# EAGLE design DCP23 (EAGLE 9.3.0)
Assembly variants: BASIC
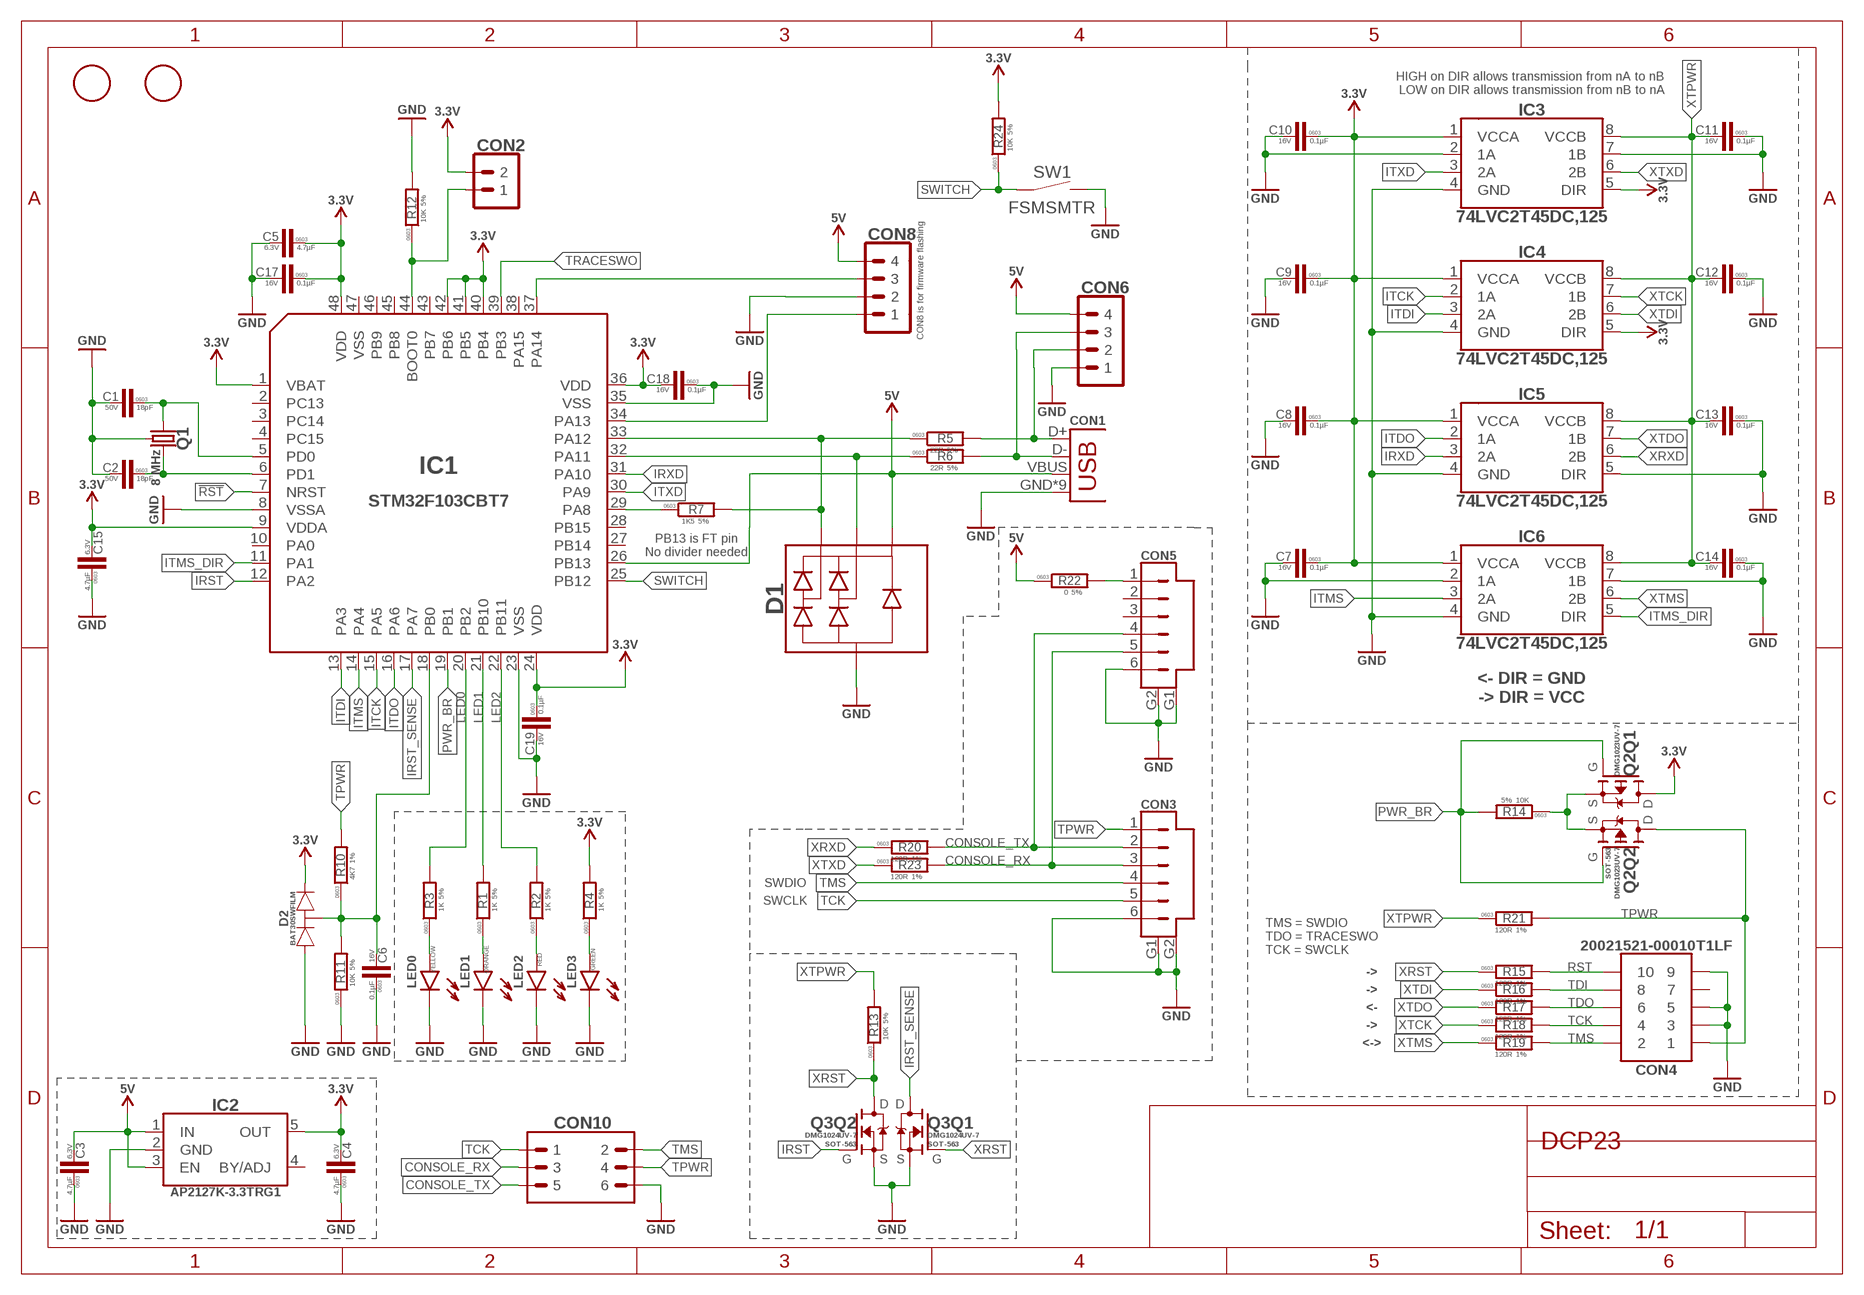
[diagram p0: schematic, sheet 1]

## Parts
C1  18pF  18PF-50V_5%_NP0-0603  [C0603]
C2  18pF  18PF-50V_5%_NP0-0603  [C0603]
C3  4.7µF  4.7µF-6.3V_10%_X5R-0603  [C0603]
C4  4.7µF  4.7µF-6.3V_10%_X5R-0603  [C0603]
C5  4.7µF  4.7µF-6.3V_10%_X5R-0603  [C0603]
C6  0.1µF  0.1µF-16V_10%_X7R-0603  [C0603]
C7  0.1µF  0.1µF-16V_10%_X7R-0603  [C0603]
C8  0.1µF  0.1µF-16V_10%_X7R-0603  [C0603]
C9  0.1µF  0.1µF-16V_10%_X7R-0603  [C0603]
C10  0.1µF  0.1µF-16V_10%_X7R-0603  [C0603]
C11  0.1µF  0.1µF-16V_10%_X7R-0603  [C0603]
C12  0.1µF  0.1µF-16V_10%_X7R-0603  [C0603]
C13  0.1µF  0.1µF-16V_10%_X7R-0603  [C0603]
C14  0.1µF  0.1µF-16V_10%_X7R-0603  [C0603]
C15  4.7µF  4.7µF-6.3V_10%_X5R-0603  [C0603]
C17  0.1µF  0.1µF-16V_10%_X7R-0603  [C0603]
C18  0.1µF  0.1µF-16V_10%_X7R-0603  [C0603]
C19  0.1µF  0.1µF-16V_10%_X7R-0603  [C0603]
CON1  USB-1  [MICRO_USB_WITH_PEGS]
CON2  PINHEAD_1X02-2  [1X02-PTH-2]  (not fitted in variant BASIC)
CON3  CON-6P-SM06B  [SM06B]
CON4  CON-2X5P  [200215-00010T1LF]
CON5  CON-6P-DF13  [DF13C-6P-1.25V]
CON6  PINHEAD_1X04-2.54  [1X04-PTH-2.54]  (not fitted in variant BASIC)
CON8  PINHEAD_1X04-2.54  [1X04-PTH-2.54]  (not fitted in variant BASIC)
CON10  PINHEAD_2X03-PTH-2.54  [2X03-PTH-2.54]  (not fitted in variant BASIC)
D1  PRTR5V0U2X  [SOT143B]
D2  BAT30SWFILM  [SC70]
IC1  STM32F103CBT7  [LQFP48]
IC2  AP2127-3.3  [SOT23-5]
IC3  74LVC2T45  [VSSOP8]
IC4  74LVC2T45  [VSSOP8]
IC5  74LVC2T45  [VSSOP8]
IC6  74LVC2T45  [VSSOP8]
LED0  LED-0603  [LED0603]
LED1  LED-0603  [LED0603]
LED2  LED-0603  [LED0603]
LED3  LED-0603  [LED0603]
Q1  8 MHz  CRYSTAL-4P-8MHZ-3.2X5-4P  [OSCILLATOR-5.0X3.2-4P]
Q2  DMG1023UV-7  [SOT-563]
Q3  DMG1024UV-7  [SOT-563]
R1  1K  1K-5%-0603  [R0603]
R2  1K  1K-5%-0603  [R0603]
R3  1K  1K-5%-0603  [R0603]
R4  1K  1K-5%-0603  [R0603]
R5  22R  R-5%-0603  [R0603]
R6  22R  R-5%-0603  [R0603]
R7  1K5  R-5%-0603  [R0603]
R10  4K7  4K7-1%-0603  [R0603]
R11  10K  10K-5%-0603  [R0603]
R12  10K  10K-5%-0603  [R0603]
R13  10K  10K-5%-0603  [R0603]
R14  10K  10K-5%-0603  [R0603]
R15  120R  120R-1%-0603  [R0603]
R16  120R  120R-1%-0603  [R0603]
R17  120R  120R-1%-0603  [R0603]
R18  120R  120R-1%-0603  [R0603]
R19  120R  120R-1%-0603  [R0603]
R20  120R  120R-1%-0603  [R0603]
R21  120R  120R-1%-0603  [R0603]
R22  0  0R-5%-0603  [R0603]
R23  120R  120R-1%-0603  [R0603]
R24  10K  10K-5%-0603  [R0603]
SW1  TACT_SWITCH-FSMSM  [FSMSM]
U$9  FIDUCIALMOUNT  [FIDUCIA-MOUNT]  (not fitted in variant BASIC)
U$10  FIDUCIALMOUNT  [FIDUCIA-MOUNT]  (not fitted in variant BASIC)

## Nets
!RST: IC1.7(NRST)
CONSOLE_RX: CON3.3 CON5.5 CON10.3 R23.P$2
CONSOLE_TX: CON3.2 CON5.4 CON10.5 R20.P$2
GND: C1.P$2 C2.P$2 C3.P$1 C4.P$1 C5.P$2 C6.P$1 C7.P$2 C8.P$2 C9.P$2 C10.P$2 C11.P$1 C12.P$1 C13.P$1 C14.P$1 C15.P$1 C17.P$2 C18.P$1 C19.P$2 CON1.GND CON1.GND1(GND) CON1.GND2(GND) CON1.GND3(GND) CON1.GND4(GND) CON1.P$1(GND) CON1.P$2(GND) CON1.P$3(GND) CON1.P$4(GND) CON3.6 CON3.G1 CON3.G2 CON4.3 CON4.5 CON4.9 CON5.6 CON5.G1(G2) CON5.G2(G1) CON6.1 CON8.2 CON10.6 D1.1(C) D2.1(A) IC1.8(VSSA) IC1.23(VSS) IC1.35(VSS) IC2.2(GND) IC3.2(1A) IC3.4(GND) IC3.7(1B) IC4.4(GND) IC5.4(GND) IC5.5(DIR) IC6.2(1A) IC6.4(GND) IC6.7(1B) LED0.C LED1.C LED2.C LED3.C Q1.2(GND) Q1.4(GND) Q3.1(Q1:S) Q3.4(Q2:S) R11.P$1 R12.P$2 SW1.P$2
IRST: IC1.12(PA2) Q3.5(Q2:G)
IRST_SENSE: IC1.17(PA7) Q3.6(Q1:D)
IRXD: IC1.31(PA10) IC5.3(2A)
ITCK: IC1.15(PA5) IC4.2(1A)
ITDI: IC1.13(PA3) IC4.3(2A)
ITDO: IC1.16(PA6) IC5.2(1A)
ITMS: IC1.14(PA4) IC6.3(2A)
ITMS_DIR: IC1.11(PA1) IC6.5(DIR)
ITXD: IC1.30(PA9) IC3.3(2A)
LED0: IC1.20(PB2) R3.P$2
LED1: IC1.21(PB10) R1.P$2
LED2: IC1.22(PB11) R2.P$2
N$1: C1.P$1 IC1.5(PD0) Q1.1
N$2: LED0.A R3.P$1
N$3: C2.P$1 IC1.6(PD1) Q1.3
N$4: LED2.A R2.P$1
N$5: LED1.A R1.P$1
N$6: LED3.A R4.P$1
N$7: IC1.29(PA8) R7.1
N$8: D1.3(D2) IC1.32(PA11) R6.1
N$9: D1.2(D1) IC1.33(PA12) R5.1 R7.2
N$12: Q2.1(Q2:S) Q2.4(Q1:S) R14.P$1
N$13: CON5.1 R22.P$2
N$15: CON2.1 IC1.44(BOOT0) R12.P$1
PWR_BR: IC1.19(PB1) Q2.2(Q2:G) Q2.5(Q1:G) R14.P$2
RST: CON4.10 R15.P$2
SWCLK: CON8.3 IC1.37(PA14)
SWDIO: CON8.1 IC1.34(PA13)
SWITCH: IC1.25(PB12) R24.P$1 SW1.P$1
TCK: CON3.5 CON4.4 CON10.1 R18.P$2
TDI: CON4.8 R16.P$2
TDO: CON4.6 R17.P$2
TMS: CON3.4 CON4.2 CON10.2 R19.P$2
TPWR: CON3.1 CON4.1 CON10.4 Q2.6(Q2:D) R10.P$2 R21.P$2
TRACESWO: IC1.39(PB3)
USB_DM: CON1.D- CON6.3 R6.2
USB_DP: CON1.D+ CON6.2 R5.2
VBUS1: C6.P$2 D2.3(COMMON) IC1.18(PB0) R10.P$1 R11.P$2
VDD_3V3: C4.P$2 C5.P$1 C7.P$1 C8.P$1 C9.P$1 C10.P$1 C15.P$2 C17.P$1 C18.P$2 C19.P$1 CON2.2 D2.2(C) IC1.1(VBAT) IC1.9(VDDA) IC1.24(VDD) IC1.36(VDD) IC1.40(PB4) IC1.41(PB5) IC1.42(PB6) IC1.48(VDD) IC2.5(OUT) IC3.1(VCCA) IC3.5(DIR) IC4.1(VCCA) IC4.5(DIR) IC5.1(VCCA) IC6.1(VCCA) Q2.3(Q1:D) R4.P$2 R24.P$2 ; supply symbol labelled 3.3V
VDD_5V: C3.P$2 CON1.VBUS CON6.4 CON8.4 D1.4(A) IC1.26(PB13) IC2.1(IN) IC2.3(EN) R22.P$1 ; supply symbol labelled 5V
XRST: Q3.2(Q1:G) Q3.3(Q2:D) R13.P$1 R15.P$1
XRXD: IC5.6(2B) R20.P$1
XTCK: IC4.7(1B) R18.P$1
XTDI: IC4.6(2B) R16.P$1
XTDO: IC5.7(1B) R17.P$1
XTMS: IC6.6(2B) R19.P$1
XTPWR: C11.P$2 C12.P$2 C13.P$2 C14.P$2 IC3.8(VCCB) IC4.8(VCCB) IC5.8(VCCB) IC6.8(VCCB) R13.P$2 R21.P$1
XTXD: IC3.6(2B) R23.P$1
Unconnected: CON4.7 CON5.2 CON5.3 IC1.2(PC13) IC1.3(PC14) IC1.4(PC15) IC1.10(PA0) IC1.27(PB14) IC1.28(PB15) IC1.38(PA15) IC1.43(PB7) IC1.45(PB8) IC1.46(PB9) IC1.47(VSS) IC2.4(BY/ADJ)

## Notes on the sheet
- HIGH on DIR allows transmission from nA to nB 
  LOW on DIR allows transmission from nB to nA
- CON8 is for firmware flashing
- PB13 is FT pin
  No divider needed
- <- DIR = GND
  -> DIR = VCC
- SWDIO
- SWCLK
- TMS = SWDIO
  TDO = TRACESWO
  TCK = SWCLK
- ->
- ->
- <-
- ->
- <->

## Library data of the parts
C1 C2 = C_digikey:18PF; DIGIKEY#: 445-1272-2-ND; MANF: TDK Corporation; MANF#: C1608C0G1H180J080AA; OPERATING_TEMP: -55°C ~ 125°C; PACKAGE: 0603; TC: C0G, NP0; TOLERANCE: +-5%; VOLTAGE: 50V
C3-C5 C15 = C_digikey:4.7µF; DIGIKEY#: 490-3297-1-ND; MANF: Murata Electronics North America; MANF#: GRM188R60J475KE19D; OPERATING_TEMP: -55°C ~ 85°C; PACKAGE: 0603; TC: X5R; TOLERANCE: +-10%; VOLTAGE: 6.3V
C6-C14 C17-C19 = C_digikey:0.1µF; DIGIKEY#: 490-1532-1-ND; MANF: Murata Electronics North America; MANF#: GRM188R71C104KA01D; OPERATING_TEMP: -55°C ~ 125°C; PACKAGE: 0603; TC: X7R; TOLERANCE: +-10%; VOLTAGE: 16V
CON1 = Connectors:USB: Connector Receptacle USB - micro B 2.0 5 Position; DIGIKEY#: 609-4616-1-ND; MANF: FCI; MANF#: 10118193-0001LF
CON2 = pinhead:PINHEAD_1X02: pinheader 2P
CON3 = Connectors:CON-6P: CONN HEADER 6 POS; DIGIKEY#: 455-1806-1-ND; MANF: JST Sales America Inc; MANF#: SM06B-SRSS-TB(LF)(SN)
CON4 = Connectors:CON-2X5P; DIGIKEY#: 609-4054-ND; MANF: Amphenol ICC (FCI); MANF#: 20021521-00010T1LF
CON5 = Connectors:CON-6P: CONN HEADER 6 POS; DIGIKEY#: H3423-ND; MANF: Hirose Electric Co Ltd; MANF#: DF13C-6P-1.25V(20)
CON6 CON8 = pinhead:PINHEAD_1X04
CON10 = pinhead:PINHEAD_2X03
D1 = TVS_diodes:PRTR5V0U2X; DIGIKEY#: 568-4140-2-ND; MANF: NXP USA Inc; MANF#: PRTR5V0U2X,215
D2 = Diodes:BAT30SWFILM: Diode Array 1 Pair Series Connection Schottky 30V 300mA (DC) Surface Mount SC-70, SOT-323; DIGIKEY#: 497-5553-2-ND; MANF: STMicroelectronics; MANF#: BAT30SWFILM
IC1 = stm32:STM32F103CBT7: ARM® Cortex®-M3 STM32F1 Microcontroller IC 32-Bit 72MHz 128KB (128K x 8) FLASH 48-LQFP (7x7); DIGIKEY#: 497-11518-ND; MANF: STMicroelectronics; MANF#: STM32F103CBT7
IC2 = linear regulators:AP2127: IC REG LINEAR 3.3V 300MA SOT23-5; DIGIKEY#: AP2127K-3.3TRG1DITR-ND; I_MAX: 300mA; MANF: Diodes Incorporated; MANF#: AP2127K-3.3TRG1; V_MAX: 6V
IC3-IC6 = misc:74LVC2T45: Voltage Level Translator Bidirectional 1 Circuit 2 Channel 420Mbps; DIGIKEY#: 1727-4578-2-ND; MANF: Nexperia USA Inc; MANF#: 74LVC2T45DC,125
LED0 = rc:LED: SMD LED; COLOR: YELLOW; DIGIKEY#: 160-1448-1-ND
LED1 = rc:LED: SMD LED; COLOR: ORANGE; DIGIKEY#: 160-1445-1-ND
LED2 = rc:LED: SMD LED; COLOR: RED; DIGIKEY#: SML-D12U1WT86CT-ND
LED3 = rc:LED: SMD LED; COLOR: GREEN; DIGIKEY#: 160-1446-1-ND
Q1 = crystal:CRYSTAL-4P: Smd Crystal 18pF; DIGIKEY#: 535-9720-2-ND; MANF: Abracon LLC; MANF#: ABM3B-8.000MHZ-B2-T
Q2 = mosfet:DMG1023UV-7: Mosfet Array 2 P-Channel (Dual) 20V 1.03A 530mW Surface Mount SOT-563; DIGIKEY#: DMG1023UV-7DICT-ND; MANF: Diodes Incorporated; MANF#: DMG1023UV-7; PACKAGE: SOT-563
Q3 = mosfet:DMG1024UV-7: Mosfet Array 2 N-Channel (Dual) 20V 1.38A 530mW Surface Mount SOT-563; DIGIKEY#: DMG1024UV-7DICT-ND; MANF: Diodes Incorporated; MANF#: DMG1024UV-7; PACKAGE: SOT-563
R1-R4 = R_digikey:1K; DIGIKEY#: 311-1.0KGRCT-ND; MANF: Yageo; MANF#: RC0603JR-071KL; PACKAGE: 0603; TOLERANCE: 5%
R5 R6 = rc:R; DIGIKEY#: 311-22NCT-ND; MANF: Yageo; MANF#: RC0201JR-0722RL; PACKAGE: 0603; TOLERANCE: 5%
R7 = rc:R; DIGIKEY#: 311-1.50KHRCT-ND; MANF: Yageo; MANF#: RC0603FR-071K5L; PACKAGE: 0603; TOLERANCE: 5%
R10 = R_digikey:4K7; DIGIKEY#: 311-4.70KHRCT-ND; MANF: Yageo; MANF#: RC0603FR-074K7L; PACKAGE: 0603; TOLERANCE: 1%
R11-R14 R24 = R_digikey:10K; DIGIKEY#: 311-10KGRCT-ND; MANF: Yageo; MANF#: RC0603JR-0710KL; PACKAGE: 0603; TOLERANCE: 5%
R15-R21 R23 = R_digikey:120R; DIGIKEY#: YAG3563CT-ND; MANF: Yageo; MANF#: AC0603FR-07120RL; PACKAGE: 0603; TOLERANCE: 1%
R22 = R_digikey:0R; DIGIKEY#: 311-0.0GRCT-ND; MANF: Yageo; MANF#: RC0603JR-070RL; PACKAGE: 0603; TOLERANCE: 5%
SW1 = misc:TACT_SWITCH: tact switch; DIGIKEY#: 450-1140-ND; I: 0.05A; MANF: TE Connectivity ALCOSWITCH Switches; MANF#: FSMSMTR; V: 24V
U$9 U$10 = usb2can_master_lib:FIDUCIALMOUNT

## Board
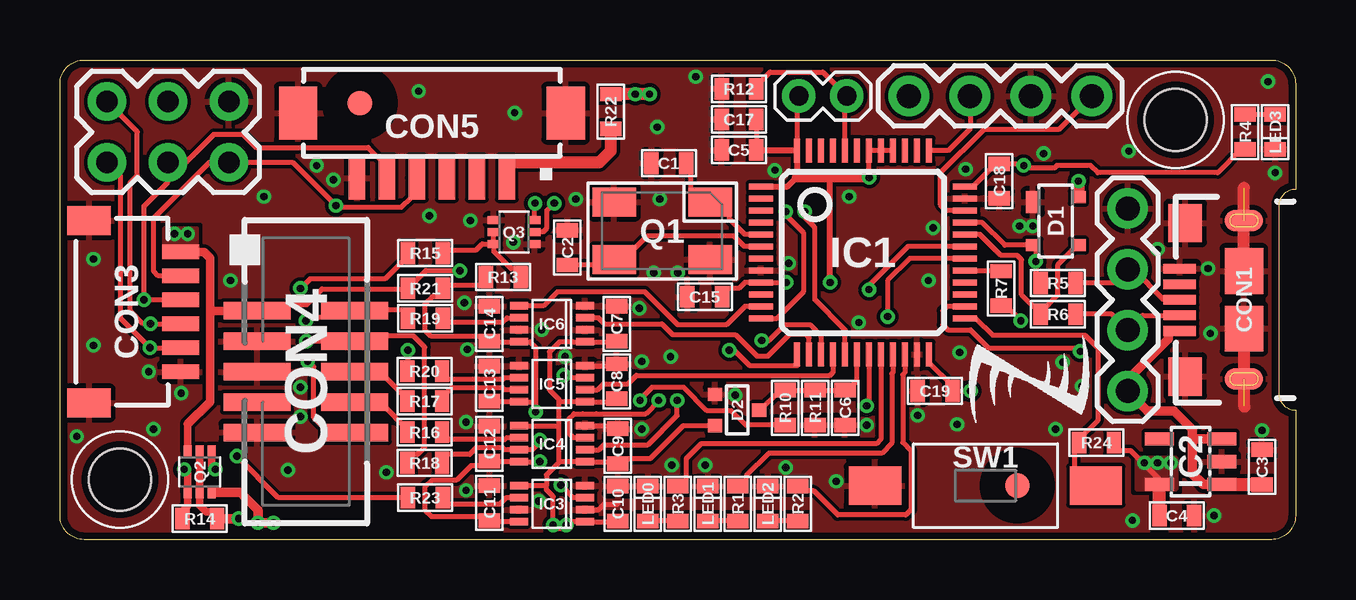
[diagram p1: board, top side]
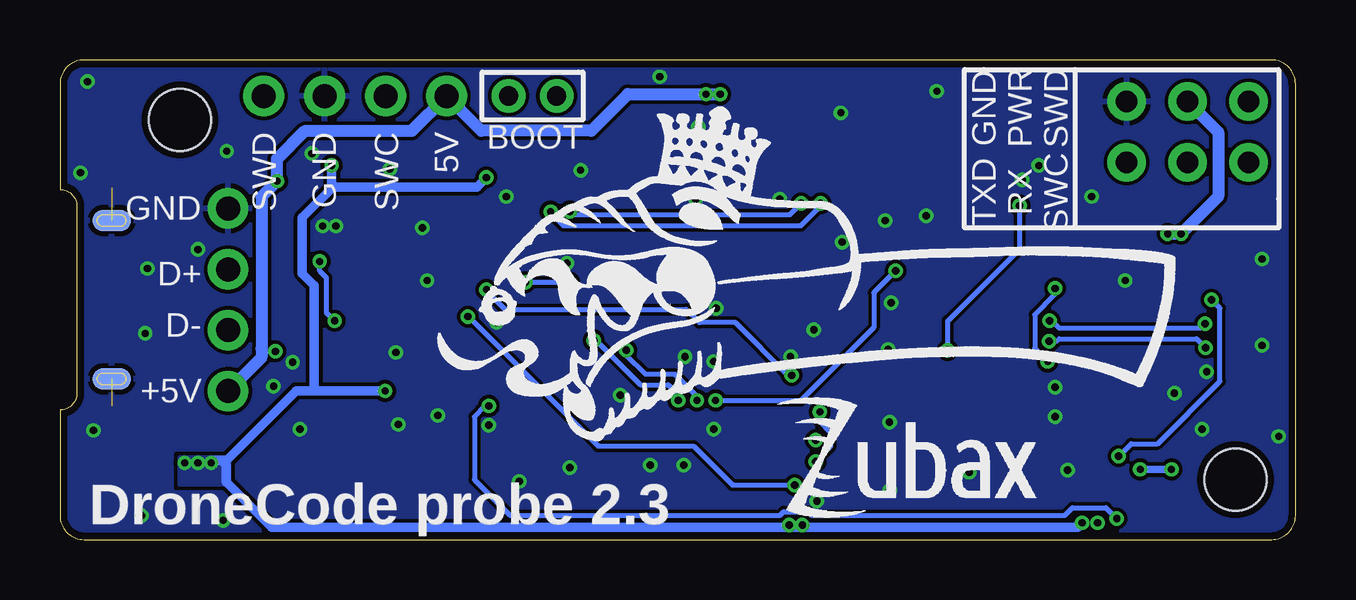
[diagram p2: board, bottom side, seen from below]

Size 51.5 x 20 mm. Coordinates in mm from the lower left corner, seen from the top.
Outline: 51.5,5.4 51.5,1 arc-90 50.5,0 1,0 arc-90 0,1 0,19 arc-90 1,20 50.5,20 arc-90 51.5,19 51.5,14.6 arc90 50.8,13.9 50.8,12.7 50.8,6.1 arc90 51.5,5.4
Copper layers (1*16): Top 0.035mm / dielectric 1.2mm / Bottom 0.035mm
Design rules "design_rules *": minimum track width 0.2mm, minimum drill 0.2mm, track to track 0.15mm, track to pad 0.15mm, pad to pad 0.15mm, via to via 0.15mm, smd to smd 0.15mm, copper to edge 0.3mm, drill to drill 0.2mm, minimum pad ring 0.125mm, minimum via ring 0.125mm, stop-mask expansion 1mil, vias tented up to drill 0.31mm, thermal gap 8mil
Holes 2.6 mm at 2.5,2.5 46.5,17.5

### Footprints (pad centres in the part's own frame; a part is rotated, then mirrored left to right if it is on the bottom)
C0603 = smd 0.6 x 0.9: P$1 -0.725,0; P$2 0.725,0
MICRO_USB_WITH_PEGS = smd 0.4 x 1.35: D+ 0,2.68; D- -0.65,2.68; GND 1.3,2.68; ID 0.65,2.68; VBUS -1.3,2.68 | smd 1.9 x 1.6: GND1 -1.2,0; GND2 1.2,0 | smd 1.6 x 1.4: GND3 -3.2,2.45; GND4 3.2,2.45 | smd 0.9 x 1.6: P$1 -3.3,0; P$2 3.3,0 | smd 0.9 x 1.6 bottom: P$3 -3.3,0; P$4 3.3,0
1X02-PTH-2 = drill 0.8 pad 1.4: 1 -1,0; 2 1,0
SM06B = smd 0.6 x 1.55: 1 -2.5,2.275; 2 -1.5,2.275; 3 -0.5,2.275; 4 0.5,2.275; 5 1.5,2.275; 6 2.5,2.275 | smd 1.2 x 1.8: G1 -3.8,-1.55; G2 3.8,-1.55
200215-00010T1LF = smd 0.737 x 2.794: 1 -2.54,-2.032; 2 -2.54,2.032; 3 -1.27,-2.032; 4 -1.27,2.032; 5 0,-2.032; 6 0,2.032; 7 1.27,-2.032; 8 1.27,2.032; 9 2.54,-2.032; 10 2.54,2.032
DF13C-6P-1.25V = smd 0.7 x 1.8: 1 -3.125,2.17; 2 -1.875,2.17; 3 -0.625,2.17; 4 0.625,2.17; 5 1.875,2.17; 6 3.125,2.17 | smd 1.6 x 2.2: G1 -5.575,-0.53; G2 5.575,-0.53
1X04-PTH-2.54 = drill 1 pad 1.7: 1 -3.81,0; 2 -1.27,0; 3 1.27,0; 4 3.81,0
2X03-PTH-2.54 = drill 0.9 pad 1.6: 1 -1.27,2.54; 2 1.27,2.54; 3 -1.27,0; 4 1.27,0; 5 -1.27,-2.54; 6 1.27,-2.54
SOT143B = smd 0.9 x 0.6: 1 -0.8,-0.95 | smd 0.5 x 0.6: 2 1,-0.95; 3 1,0.95; 4 -1,0.95
SC70 = smd 0.55 x 0.6: 1 -0.65,-0.925; 2 0.65,-0.925; 3 0,0.925
LQFP48 = smd 1 x 0.25: 1 -4.25,2.75; 2 -4.25,2.25; 3 -4.25,1.75; 4 -4.25,1.25; 5 -4.25,0.75; 6 -4.25,0.25; 7 -4.25,-0.25; 8 -4.25,-0.75; 9 -4.25,-1.25; 10 -4.25,-1.75; 11 -4.25,-2.25; 12 -4.25,-2.75; 25 4.25,-2.75; 26 4.25,-2.25; 27 4.25,-1.75; 28 4.25,-1.25; 29 4.25,-0.75; 30 4.25,-0.25; 31 4.25,0.25; 32 4.25,0.75; 33 4.25,1.25; 34 4.25,1.75; 35 4.25,2.25; 36 4.25,2.75 | smd 0.25 x 1: 13 -2.75,-4.25; 14 -2.25,-4.25; 15 -1.75,-4.25; 16 -1.25,-4.25; 17 -0.75,-4.25; 18 -0.25,-4.25; 19 0.25,-4.25; 20 0.75,-4.25; 21 1.25,-4.25; 22 1.75,-4.25; 23 2.25,-4.25; 24 2.75,-4.25; 37 2.75,4.25; 38 2.25,4.25; 39 1.75,4.25; 40 1.25,4.25; 41 0.75,4.25; 42 0.25,4.25; 43 -0.25,4.25; 44 -0.75,4.25; 45 -1.25,4.25; 46 -1.75,4.25; 47 -2.25,4.25; 48 -2.75,4.25
SOT23-5 = smd 0.55 x 1.2: 1 -0.95,-1.3; 2 0,-1.3; 3 0.95,-1.3; 4 0.95,1.3; 5 -0.95,1.3
VSSOP8 = smd 0.75 x 0.3: 1 -1.375,0.75; 2 -1.375,0.25; 3 -1.375,-0.25; 4 -1.375,-0.75; 5 1.375,-0.75; 6 1.375,-0.25; 7 1.375,0.25; 8 1.375,0.75
LED0603 = smd 0.6 x 0.9: A -0.725,0; C 0.725,0
OSCILLATOR-5.0X3.2-4P = smd 1.8 x 1.2: 1 -2,-1.2; 2 2,-1.2; 3 2,1.2; 4 -2,1.2
SOT-563 = smd 0.5 x 0.325: 1 -0.85,0.5; 2 -0.85,0; 3 -0.85,-0.5; 4 0.85,-0.5; 5 0.85,0; 6 0.85,0.5
R0603 = smd 0.6 x 0.9: P$1 -0.725,0; P$2 0.725,0
R0603' = smd 0.6 x 0.9: 1 -0.725,0; 2 0.725,0
FSMSM = smd 2.18 x 1.6: P$1 -4.6,0; P$2 4.6,0
FIDUCIA-MOUNT = smd 1.016 x 1.016: P$1 0,0

### Placement (x,y rotation side)
C1  25.38,15.7 180 top
C2  21.15,12.18 90 top
C3  50.1,3.03 270 top
C4  46.55,1 180 top
C5  28.3,16.25 180 top
C6  32.73,5.5 90 top
C7  23.2,9 90 top
C8  23.2,6.6 90 top
C9  23.25,3.9 90 top
C10  23.25,1.5 90 top
C11  17.9,1.53 270 top
C12  17.9,4 270 top
C13  17.9,6.5 270 top
C14  17.9,9 270 top
C15  26.88,10.12 0 top
C17  28.3,17.52 180 top
C18  39.15,14.95 90 top
C19  36.48,6.2 180 top
CON1  49.35,10 90 top
CON2  31.8,18.5 180 top
CON3  2.76,9.5 270 top
CON4  10.25,7 270 top
CON5  15.5,17.25 180 top
CON6  44.5,10 270 top
CON8  39.2,18.5 180 top
CON10  4.5,17 90 top
D1  41.5,13.28 270 top
D2  28.23,5.4 270 top
IC1  33.48,11.97 0 top
IC2  47.12,3.25 90 top
IC3  20.5,1.5 180 top
IC4  20.5,4 180 top
IC5  20.5,6.5 180 top
IC6  20.5,9 180 top
LED0  24.5,1.5 90 top
LED1  27,1.5 90 top
LED2  29.5,1.5 90 top
LED3  50.65,17 270 top
Q1  25.1,12.88 180 top
Q2  5.82,2.83 90 top
Q3  18.93,12.82 0 top
R1  28.25,1.5 90 top
R2  30.75,1.5 90 top
R3  25.75,1.5 90 top
R4  49.4,17 270 top
R5  22R  [R0603']  41.6,10.7 0 top
R6  22R  [R0603']  41.6,9.4 0 top
R7  1K5  [R0603']  39.23,10.47 270 top
R10  30.23,5.5 270 top
R11  31.48,5.5 90 top
R12  28.3,18.8 180 top
R13  18.48,10.95 180 top
R14  5.82,0.88 0 top
R15  15.22,11.95 180 top
R16  15.2,4.47 180 top
R17  15.2,5.78 180 top
R18  15.2,3.2 180 top
R19  15.22,9.22 180 top
R20  15.2,7.03 180 top
R21  15.22,10.47 180 top
R22  22.95,17.85 270 top
R23  15.22,1.75 180 top
R24  43.2,4.05 0 top
SW1  38.58,2.25 180 top
U$1  [DRAGON-30X13]  35.77,4.05 0 bottom
U$2  [Z_LOGO_5]  37.7,8.6 270 top
U$3  [ZUBAX_LOGO_5X10]  21.68,0.72 0 bottom
U$9  39.9,2.25 0 top
U$10  12.5,18.2 0 top

### Tracks (layer width: path | path; a pad name or v marks a point on that pad's centre or on a via)
CONSOLE_RX  (via drill 0.3 pad 0.6)
  Top 0.2: R23.P$2 9.1,1.75 v7.38,3.47 | CON3.3 v3.5,10 3.5,13.91 4.5,14.91 CON10.3 5.25,15.73 6.43,16.91 7.62,16.91 8.18,16.35 12.85,16.35 13.62,15.57 13.62,15.5 CON5.5
  Bottom 0.2: v7.38,3.47 6.85,4 5.75,4 3.15,6.6 3.15,9.65 v3.5,10
CONSOLE_TX  (via drill 0.3 pad 0.6)
  Top 0.2: CON3.2 4.1,11 3.9,11.2 3.9,13.4 6.23,15.73 CON10.5 9.7,15.73 v11.5,13.93 11.57,13.85 14.22,13.85 14.62,14.25 14.62,15.08 CON5.4 | R20.P$2 14.5,7.05 v14.5,7.9
  Bottom 0.2: v14.5,7.9 14.5,9.12 11.5,12.12 v11.5,13.93
GND  (via drill 0.3 pad 0.6)  (4 unrouted)
  Top 0.2: D1.1 40.65,14.07 | IC4.4 23.12,4.75 C9.P$2 | IC5.4 23.12,7.25 C8.P$2 | IC3.2 22.45,1.25 22.68,1.47 23.25,1.47
  Top 0.5: CON1.GND2 49.35,14.68 | CON1.GND1 49.35,5.58 49.38,5.55
  other vias: 47.85,11.3 50.65,15.3 32.35,2.42 30.25,3 26.9,3.1 50.1,4.55 48.1,1 33.62,4.78 28.15,6.03 40,13.07 35.75,5.17 41,16.1 37.75,15.45 40.55,13.07 5.05,6.1 3.7,7 24.15,9.65 24.75,11.12 25.75,11.12 21.05,7.62 24.25,4.6 25.5,3.1 20.07,8.75 16.93,4.9 30.38,11.53 16.98,7.92 16.85,9.88 19.95,1.6 16.93,2.05 10.02,6.35 10.02,5.12 0.7,4.3 3.9,4.6 1.4,11.7 1.4,8.1 7.1,10.8 8.5,14.3 15.4,13.5 9.5,2.9 13.6,2.8 37.4,4.8 37.5,7.8 41.8,7.4 44.7,0.8 17.1,13.3 18.9,12.4 21.5,14.2 25,14.2 24.9,17.2 26.5,19.3 29.8,15.4 32.9,14.3 36.4,13 36.2,10.8 33.3,9.05 24.25,7.42 25.45,7.62 41.5,4.6 42.6,6.4 45.75,12.1 47.95,8.6 50.35,19.1 44.55,16.2 18.95,17.8 14.95,18.7 10.7,15.6 11.4,15
  pour Bottom (rank 3): 0,20 51.5,20 51.5,0 0,0
  pour Top (rank 3): 0,20 51.5,20 51.5,0 0,0
IRST  (via drill 0.3 pad 0.6)
  Top 0.2: IC1.12 29.88,9.22 31,10.35 31,12.78 30.25,13.53 v30.25,13.68 | Q3.5 20.12,12.82 20.3,13 20.3,13.72 v20.6,14.03
  Bottom 0.2: v30.25,13.68 30.12,13.55 29.85,13.55 21.07,13.55 v20.6,14.03
IRST_SENSE  (via drill 0.3 pad 0.6)
  Top 0.2: IC1.17 32.73,8.75 31.45,10.03 31.45,13.03 31.05,13.43 v31.05,13.68 | Q3.6 19.77,14 v19.8,14.03
  Bottom 0.2: v19.8,14.03 19.8,13.9 20.63,13.07 30.5,13.07 31.05,13.62 v31.05,13.68
IRXD  (via drill 0.3 pad 0.6)
  Top 0.2: IC1.31 35.35,12.22 33.72,10.6 v33.72,10.42 | IC5.3 21.1,6.75 v21,6.85
  Bottom 0.2: v21,6.85 21.15,6.85 23.35,9.05 24.85,9.05 25.4,9.6 32.95,9.6 33.72,10.37 v33.72,10.42
ITCK  (via drill 0.3 pad 0.6)
  Top 0.2: IC1.15 31.73,8.5 31.27,8.95 30.2,8.95 29.55,8.3 v29.25,8.3 | IC4.2 22.48,3.75 22.68,3.95 24.5,3.95 25.73,5.17 v25.73,5.8
  Bottom 0.2: v29.25,8.3 29.15,8.3 27.3,6.45 26.14,6.45 25.73,6.03 v25.73,5.8
ITDI  (via drill 0.3 pad 0.6)
  Top 0.2: IC1.13 30.73,7.25 28.75,7.25 28.1,7.9 v27.9,7.9 | IC4.3 21.4,4.25 21.2,4.45 21.2,5.03 21.43,5.25 21.8,5.25 22.35,5.25 24.43,5.25 24.95,5.78 v24.95,5.8
  Bottom 0.2: v27.9,7.9 27.9,7.7 27.1,6.9 25.88,6.9 24.95,5.97 v24.95,5.8
ITDO
  Top 0.2: IC1.16 32.23,6.97 32.1,6.85 24.02,6.85 23.68,6.5 22.65,6.5 22.4,6.25 IC5.2
ITMS
  Top 0.2: IC1.14 31.23,8.43 31.1,8.55 30.42,8.55 29.52,7.65 29.05,7.65 28.15,8.55 25.53,8.55 25.08,9 22.7,9 22.45,9.25 IC6.3
ITMS_DIR
  Top 0.2: IC1.11 28.55,9.72 27.77,8.95 25.75,8.95 24.38,10.32 20.73,10.32 20.15,9.75 IC6.5
ITXD  (via drill 0.3 pad 0.6)
  Top 0.2: IC1.30 35.42,11.72 34.5,10.8 v34.5,9.3 | IC3.3 21.4,1.75 v20.88,2.28
  Bottom 0.2: v20.88,2.28 23.48,2.28 25.1,3.9 29.07,3.9 34.47,9.3 v34.5,9.3
LED0
  Top 0.2: IC1.20 34.23,4.2 34.02,4 26.73,4 26.1,3.38 26.1,2.25 26.07,2.22 R3.P$2
LED1
  Top 0.2: IC1.21 34.73,6.97 34.67,6.92 34.67,4.03 34.25,3.6 29.55,3.6 28.6,2.65 28.6,2.33 28.5,2.22 R1.P$2
LED2
  Top 0.2: IC1.22 35.23,6.97 35.12,6.88 35.12,4.05 35.48,3.7 35.48,1.25 35.25,1.03 32.42,1.03 31.43,2.03 30.95,2.03 R2.P$2
N$1
  Top 0.2: C1.P$1 26.3,15.5 26.3,14.32 26.55,14.07 Q1.1 27.38,14.07 27.9,13.55 27.9,13.37 28.55,12.72 IC1.5
N$2
  Top 0.2: R3.P$1 LED0.A
N$3
  Top 0.2: C2.P$1 22.88,11.45 arc90 Q1.3 22.98,11.55 23.38,11.55 24.48,12.65 28.1,12.65 28.52,12.22 IC1.6
N$4
  Top 0.2: R2.P$1 LED2.A
N$5
  Top 0.2: R1.P$1 LED1.A
N$6
  Top 0.2: LED3.A R4.P$1
N$7
  Top 0.2: IC1.29 39.23,11.22 R7.1
N$8
  Top 0.2: D1.3 42.4,12.28 41.6,11.47 41.6,10.2 40.88,9.47 R6.1 40.08,10.2 40.08,11.68 39.9,11.85 39.23,11.85 38.35,12.72 IC1.32
N$9  (via drill 0.3 pad 0.6)
  Top 0.2: R5.1 40.67,10.9 v40.67,11.6 40.67,12.15 D1.2 39.38,12.28 38.42,13.22 IC1.33 | R7.2 39.45,9.75 40.05,9.15 v40.05,9.12
  Bottom 0.2: v40.05,9.12 40.4,9.47 40.4,10.93 40.67,11.2 v40.67,11.6
N$12  (via drill 0.3 pad 0.6)
  Top 0.32: R14.P$1 5.1,1.18 5.32,1.4 Q2.1 5.32,2.78 v5.18,2.92 | Q2.4 6.32,3.08 v6.48,2.92
  Bottom 0.32: v6.48,2.92 v5.18,2.92
N$13
  Top 0.5: R22.P$2 22.95,16.2 22.48,15.72 18.68,15.72 18.62,15.68 CON5.1
N$15
  Top 0.2: R12.P$1 29.02,18.93 29.6,19.5 31.8,19.5 CON2.1 32.73,18.43 IC1.44
PWR_BR  (via drill 0.3 pad 0.6)
  Top 0.2: IC1.19 33.73,5.67 v33.62,5.58 | 6.68,0.88 6.55,1
  Top 0.32: R14.P$2 6.55,1 6.4,1.15 6.1,1.15 5.82,1.43 Q2.2 Q2.5
  Top 0.4: v7.45,0.88 6.68,0.88
  Bottom 0.2: v33.62,5.58 33.77,5.58 34.23,5.12 34.23,2.5 32.73,1.01 21.49,1.01 21.34,1.16 20.32,1.16 20.17,1.01 9.62,1.01 9.3,1.32 7.9,1.32 v7.45,0.88
RST  (via drill 0.3 pad 0.6)
  Top 0.2: CON4.10 11.19,4.46 10.57,5.08 10.57,7.2 10.35,7.42 v10.32,7.42 | R15.P$2 14.5,11.62 14.3,11.62 13.55,10.88 10.43,10.88 v10.02,10.47
  Bottom 0.2: v10.02,10.47 10.02,10.22 10.88,9.38 10.88,7.97 v10.32,7.42
SWCLK
  Top 0.2: IC1.37 37.02,16.23 37.96,17.16 37.96,18.47 CON8.3
SWDIO
  Top 0.2: IC1.34 36.92,13.72 36.7,13.95 36.7,15.3 38.52,17.12 41.66,17.12 43.01,18.47 CON8.1
SWITCH
  Top 0.2: SW1.P$1 42.27,2.25 42.27,4.05 R24.P$1 42.48,4.17 43.25,4.95 43.25,8 42.73,8.53 38.88,8.53 38.17,9.22 IC1.25
TCK  (via drill 0.3 pad 0.6)
  Top 0.2: v10.27,8.28 v10.28,8.27 CON4.4 12.51,8.5 14.73,8.5 15.2,8.03 15.2,3.85 14.9,3.55 14.53,3.55 14.47,3.5 R18.P$2 | CON3.5 v3.75,8 2.52,9.22 2.52,15.16 CON10.1
  Bottom 0.2: v10.27,8.28 9.95,8.28 9.85,8.38 4.12,8.38 v3.75,8
TDI
  Top 0.2: R16.P$2 14.54,4.54 13.34,5.73 CON4.8
TDO
  Top 0.2: CON4.6 13.35,7 14.47,5.88 R17.P$2
TMS  (via drill 0.3 pad 0.6)
  Top 0.2: 10.41,9.29 12.03,9.29 CON4.2 12.31,9.56 14.5,9.56 R19.P$2 | CON3.4 v3.77,9 3.48,9 2.93,9.55 2.93,14.88 3.23,15.18 3.23,17 CON10.2 | v10.25,9.12 10.41,9.29 | 10.41,9.29
  Bottom 0.2: v3.77,9 3.95,8.82 9.87,8.82 10.17,9.12 v10.25,9.12
TPWR  (via drill 0.3 pad 0.6)
  Top 0.2: CON4.1 8.47,9.79 10.27,9.79 10.93,10.45 14.45,10.45 14.47,10.47 R21.P$2 15.25,11.22 16.65,11.22 v16.66,11.21 | R10.P$2 28.57,4.78 27.98,5.38 26.98,5.38 26,6.35 24.68,6.35 24.18,5.85 v24.18,5.8 | CON3.1 4.77,12
  Top 0.32: Q2.6 5.32,4.83
  Top 0.35: 5.32,4.83 6.25,5.75 6.25,9.5 | CON3.1 6,12 6.25,11.75 6.25,9.5 | CON4.1 6.29,9.54 6.25,9.5
  Bottom 0.2: v24.18,5.8 20.62,5.8 17.57,8.85 17.57,10.3 v16.66,11.21
  Bottom 0.5: CON10.4 3.23,17 3.23,14.3 v4.77,12.75 v5.32,12.75
  pour Top (no thermals): 4.35,11.8 5.7,11.8 5.7,12.95 4.35,12.95
USB_DM
  Top 0.2: R6.2 43.83,9.4 CON6.3 45.12,9.35 CON1.D-
USB_DP
  Top 0.2: CON1.D+ 46.02,10 44.75,11.27 CON6.2 43.93,10.7 R5.2
VBUS1
  Top 0.2: IC1.18 33.23,6.62 32.83,6.22 C6.P$2 R11.P$2 R10.P$1 30.12,6.12 29.93,6.12 29.2,5.4 D2.3
VDD_3V3  (via drill 0.3 pad 0.6)
  Top 0.2: IC1.24 36.23,7.38 37.2,6.4 C19.P$1 v37.95,6.2 | C15.P$2 27.6,10.43 27.65,10.47 28.3,10.47 28.55,10.72 29,10.72 IC1.9 v30.27,10.72 | C5.P$1 29.02,16.23 C5.P$1 | 30.7,16.25 IC1.48 30.73,16.12 30.73,18.43 CON2.2 | C17.P$1 C5.P$1 | IC1.36 38.05,14.72 39,15.68 C18.P$2 40.1,15.68 v40.17,15.6 40.27,15.5 41.45,15.5 41.55,15.6 42.95,15.6 43.25,15.3 48.25,15.3 49.23,16.27 R4.P$2 | IC1.40 IC1.41 IC1.42 v33.73,15.1 | C7.P$1 23.18,8.25 IC6.1 21.38,8.25 20.82,8.25 20.4,7.83 20.4,6.25 20.8,5.85 20.8,5.75 | C8.P$1 23.07,5.75 IC5.1 20.9,5.75 20.8,5.75 | C10.P$1 23.23,0.75 IC3.1 21.32,0.75 21.12,0.55 | 45.92,2.4 44.62,3.7 43.92,3.7 R24.P$2 | 20.61,0.55 v20.56,0.61 20.56,1.79 20.27,2.08 20.27,2.25 | 20.8,3.22 20.82,3.25 21.7,3.25 IC4.1 23.18,3.25 C9.P$1 23.4,3.17 23.6,3.38 24.6,3.38 25.98,4.75 D2.2 | IC3.5 19.52,2.25 20.27,2.25 | 20.8,3.22 20.8,4.31 20.8,4.75 | 20.8,4.75 20.8,5.75 | IC4.5 20.8,4.75 | 20.27,2.25 20.27,2.7 20.8,3.22
  Top 0.25: IC1.48 30.73,15.12 30.7,15.1 30.32,14.72 IC1.1 | C5.P$1 30.7,16.25 | v32.1,10.72 32.1,15.1
  Top 0.32: Q2.3 6.38,1.97
  Top 0.4: 30.7,15.1 31.7,15.1 31.82,15.1 32.1,15.1 v33.73,15.1 | 21.12,0.55 20.61,0.55 | 6.38,1.97 7.5,1.97 8.25,1.22 v8.25,0.7 v8.9,0.7
  Top 0.55: C4.P$2 IC2.5
  Bottom 0.2: v30.27,10.72 v32.1,10.72 | v21.11,0.61 21.01,0.51 20.77,0.51 | v20.56,0.61 19.98,0.61 19.88,0.51
  Bottom 0.4: 44.75,3.3 44.55,3.3 41.65,6.2 41.2,6.2 40.9,6.2 | 44.75,3.3 45.1,3.3 v45.2,3.2 | v37.95,6.2 40.9,6.2 | 40.9,6.2 40.9,10.6 41.4,11.1 41.4,13.43 40.12,14.7 39.08,14.7 | v33.73,15.1 34.12,14.7 38.73,14.7 | 39.08,14.7 38.73,14.7 | 38.73,14.7 39.08,14.7 | 39.08,14.7 40.17,14.7 v40.17,15.6 | 44.75,3.3 44.58,3.12 44.58,2.4 42.68,0.51 20.77,0.51 20.52,0.51 19.88,0.51 9.07,0.51 v8.9,0.7
  other vias: 46.3,3.2 45.75,3.2
  pour Top (no thermals): 46.5,2.1 44.9,2.1 44.9,3.4 46.5,3.4
  pour Bottom (no thermals): 44.48,2.3 46.5,2.3 46.5,3.42 44.48,3.42
VDD_5V  (via drill 0.3 pad 0.6)
  Top 0.2: IC1.26 36.98,9.72 36.8,9.55 36.8,8.95 37,8.75 37.95,8.75 38.7,8 42.38,8 v42.52,7.85
  Top 0.4: IC2.1 47.65,2.3 47.2,2.75 47.2,4.17 | 47.2,4.17 47.2,4.6 46.42,5.38 45.31,5.38 CON6.4 44.5,6.67 46.2,8.38 46.2,8.57 46.33,8.7 CON1.VBUS | IC2.3 47.23,4.2 47.2,4.17
  Top 0.5: v42.45,14.95 D1.4 | v24.57,18.57 v23.98,18.57 R22.P$1
  Top 0.55: IC2.1 C3.P$2
  Bottom 0.2: v42.52,7.85 43,7.85 43.1,7.95
  Bottom 0.5: CON6.4 43.1,7.59 43.1,7.95 43.1,14.3 v42.45,14.95 42.45,15.88 41.27,17.05 36.84,17.05 CON8.4 33.94,17.05 29.35,17.05 27.82,18.57 v23.98,18.57
XRST
  Top 0.2: R15.P$1 15.95,12.07 17.35,12.07 17.6,12.32 Q3.3 | Q3.3 18.07,12.22 18.07,12.03 18.8,11.3 19.18,11.3 19.2,11.28 R13.P$1 | Q3.3 Q3.2
XRXD
  Top 0.2: IC5.6 18.53,6.75 18.45,6.67 16.15,6.67 15.93,6.9 R20.P$1
XTCK  (via drill 0.3 pad 0.6)
  Top 0.2: v20,4.15 20,4.08 19.68,3.75 IC4.7 18.53,3.75 18.45,3.83 17.35,3.83 17.2,3.68 17.2,3.67 17.07,3.55 15.93,3.55 R18.P$1
XTDI
  Top 0.2: IC4.6 18.63,4.25 18.55,4.17 16.23,4.17 R16.P$1
XTDO
  Top 0.2: IC5.7 18.53,6.25 18.45,6.33 16.32,6.33 16.12,6.12 16.1,6.12 15.93,5.95 R17.P$1
XTMS
  Top 0.2: R19.P$1 15.95,9.07 18.45,9.07 18.62,9.25 IC6.6
XTPWR  (via drill 0.3 pad 0.6)
  Top 0.2: C13.P$2 17.93,5.75 IC5.8 19.82,5.75 v19.82,5.33 19.82,8.03 19.6,8.25 IC6.8 17.93,8.25 C14.P$2 17.7,8.47 15.47,8.47 15.22,8.72 15.22,9.85 15.5,10.12 15.95,10.12 R21.P$1 16.07,10.6 17.75,10.6 R13.P$2 | IC3.8 17.95,0.75 C11.P$2 17.75,0.95 15.5,0.95 15.2,1.25 15.2,2.17 15.5,2.47 16.52,2.47 17.12,3.08 17.7,3.08 C12.P$2 17.93,3.25 IC4.8 v20,3.25
  Bottom 0.2: v19.82,5.33 19.82,4.9 19.4,4.47 19.39,3.86 v20,3.25
XTXD
  Top 0.2: IC3.6 18.6,1.75 18.32,1.47 16.43,1.47 16,1.47 15.95,1.53 R23.P$1

### Text on the board
bPlace: SWD | PWR | GND | BOOT | 5V | SWC | GND | SWD | SWC | RX | TXD | GND | D+ | D- | +5V | DroneCode probe 2.3